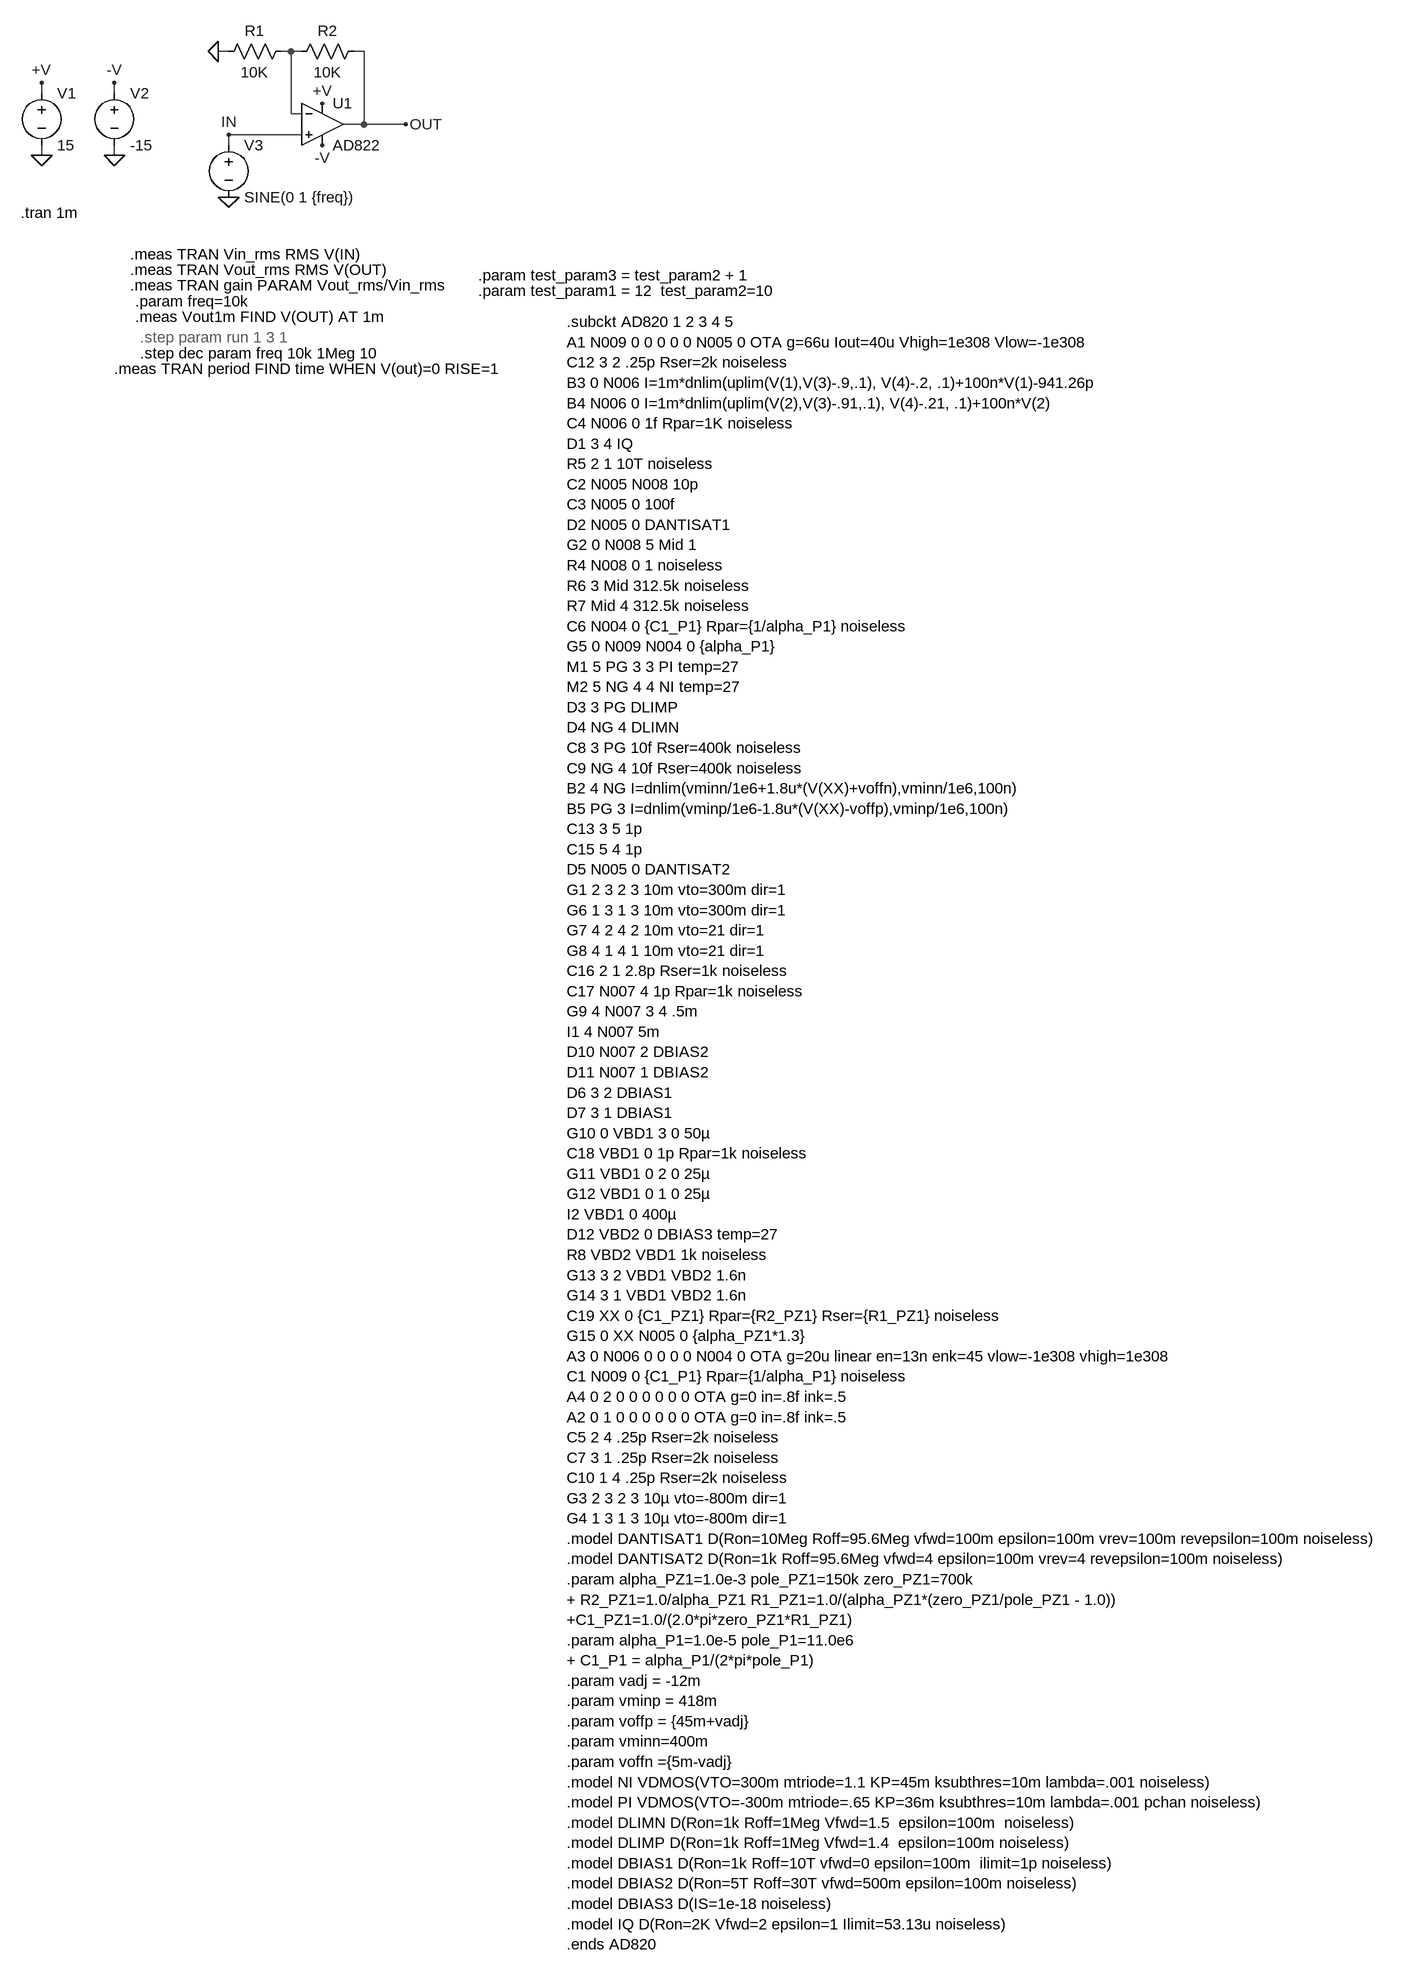
[diagram p0: schematic Batch_Test.asc]
Batch_Test.asc, the LTspice schematic file:
Version 4
SHEET 1 2320 1456
WIRE 432 -1216 416 -1216
WIRE 528 -1216 512 -1216
WIRE 544 -1216 528 -1216
WIRE 640 -1216 624 -1216
WIRE 144 -1152 144 -1168
WIRE 256 -1152 256 -1168
WIRE 528 -1120 528 -1216
WIRE 544 -1120 528 -1120
WIRE 640 -1104 640 -1216
WIRE 640 -1104 608 -1104
WIRE 704 -1104 640 -1104
WIRE 544 -1088 432 -1088
WIRE 432 -1072 432 -1088
WIRE 144 -1056 144 -1072
WIRE 256 -1056 256 -1072
FLAG 144 -1168 +V
FLAG 144 -1056 0
FLAG 704 -1104 OUT
FLAG 432 -1088 IN
FLAG 576 -1136 +V
FLAG 256 -1168 -V
FLAG 576 -1072 -V
FLAG 416 -1216 0
FLAG 256 -1056 0
FLAG 432 -992 0
SYMBOL voltage 144 -1168 R0
WINDOW 123 0 0 Left 2
WINDOW 39 0 0 Left 2
SYMATTR InstName V1
SYMATTR Value 15
SYMBOL res 528 -1232 R90
WINDOW 0 0 56 VBottom 2
WINDOW 3 32 56 VTop 2
SYMATTR InstName R1
SYMATTR Value 10K
SYMBOL res 640 -1232 R90
WINDOW 0 0 56 VBottom 2
WINDOW 3 32 56 VTop 2
SYMATTR InstName R2
SYMATTR Value 10K
SYMBOL voltage 256 -1168 R0
WINDOW 123 24 146 Left 2
WINDOW 39 24 125 Left 2
SYMATTR InstName V2
SYMATTR Value -15
SYMBOL voltage 432 -1088 R0
WINDOW 123 0 0 Left 0
WINDOW 39 0 0 Left 0
SYMATTR InstName V3
SYMATTR Value SINE(0 1 {freq})
SYMBOL Opamps\\AD822 576 -1168 R0
SYMATTR InstName U1
TEXT 112 -968 Left 2 !.tran 1m
TEXT 280 -880 Left 2 !.meas TRAN Vout_rms RMS V(OUT)
TEXT 280 -904 Left 2 !.meas TRAN Vin_rms RMS V(IN)
TEXT 280 -856 Left 2 !.meas TRAN gain PARAM Vout_rms/Vin_rms
TEXT 288 -832 Left 2 !.param freq=10k
TEXT 296 -776 Left 2 ;.step param run 1 3 1
TEXT 288 -808 Left 2 !.meas Vout1m FIND V(OUT) AT 1m
TEXT 256 -728 Left 2 !.meas TRAN period FIND time WHEN V(out)=0 RISE=1
TEXT 816 -872 Left 2 !.param test_param3 = test_param2 + 1
TEXT 816 -848 Left 2 !.param test_param1 = 12  test_param2=10
TEXT 296 -752 Left 2 !.step dec param freq 10k 1Meg 10
TEXT 952 -800 Left 2 !.subckt AD820 1 2 3 4 5\nA1 N009 0 0 0 0 0 N005 0 OTA g=66u Iout=40u Vhigh=1e308 Vlow=-1e308\nC12 3 2 .25p Rser=2k noiseless\nB3 0 N006 I=1m*dnlim(uplim(V(1),V(3)-.9,.1), V(4)-.2, .1)+100n*V(1)-941.26p\nB4 N006 0 I=1m*dnlim(uplim(V(2),V(3)-.91,.1), V(4)-.21, .1)+100n*V(2)\nC4 N006 0 1f Rpar=1K noiseless\nD1 3 4 IQ\nR5 2 1 10T noiseless\nC2 N005 N008 10p\nC3 N005 0 100f\nD2 N005 0 DANTISAT1\nG2 0 N008 5 Mid 1\nR4 N008 0 1 noiseless\nR6 3 Mid 312.5k noiseless\nR7 Mid 4 312.5k noiseless\nC6 N004 0 {C1_P1} Rpar={1/alpha_P1} noiseless\nG5 0 N009 N004 0 {alpha_P1}\nM1 5 PG 3 3 PI temp=27\nM2 5 NG 4 4 NI temp=27\nD3 3 PG DLIMP\nD4 NG 4 DLIMN\nC8 3 PG 10f Rser=400k noiseless\nC9 NG 4 10f Rser=400k noiseless\nB2 4 NG I=dnlim(vminn/1e6+1.8u*(V(XX)+voffn),vminn/1e6,100n)\nB5 PG 3 I=dnlim(vminp/1e6-1.8u*(V(XX)-voffp),vminp/1e6,100n)\nC13 3 5 1p\nC15 5 4 1p\nD5 N005 0 DANTISAT2\nG1 2 3 2 3 10m vto=300m dir=1\nG6 1 3 1 3 10m vto=300m dir=1\nG7 4 2 4 2 10m vto=21 dir=1\nG8 4 1 4 1 10m vto=21 dir=1\nC16 2 1 2.8p Rser=1k noiseless\nC17 N007 4 1p Rpar=1k noiseless\nG9 4 N007 3 4 .5m\nI1 4 N007 5m\nD10 N007 2 DBIAS2\nD11 N007 1 DBIAS2\nD6 3 2 DBIAS1\nD7 3 1 DBIAS1\nG10 0 VBD1 3 0 50µ\nC18 VBD1 0 1p Rpar=1k noiseless\nG11 VBD1 0 2 0 25µ\nG12 VBD1 0 1 0 25µ\nI2 VBD1 0 400µ\nD12 VBD2 0 DBIAS3 temp=27\nR8 VBD2 VBD1 1k noiseless\nG13 3 2 VBD1 VBD2 1.6n\nG14 3 1 VBD1 VBD2 1.6n\nC19 XX 0 {C1_PZ1} Rpar={R2_PZ1} Rser={R1_PZ1} noiseless\nG15 0 XX N005 0 {alpha_PZ1*1.3}\nA3 0 N006 0 0 0 0 N004 0 OTA g=20u linear en=13n enk=45 vlow=-1e308 vhigh=1e308\nC1 N009 0 {C1_P1} Rpar={1/alpha_P1} noiseless\nA4 0 2 0 0 0 0 0 0 OTA g=0 in=.8f ink=.5\nA2 0 1 0 0 0 0 0 0 OTA g=0 in=.8f ink=.5\nC5 2 4 .25p Rser=2k noiseless\nC7 3 1 .25p Rser=2k noiseless\nC10 1 4 .25p Rser=2k noiseless\nG3 2 3 2 3 10µ vto=-800m dir=1\nG4 1 3 1 3 10µ vto=-800m dir=1\n.model DANTISAT1 D(Ron=10Meg Roff=95.6Meg vfwd=100m epsilon=100m vrev=100m revepsilon=100m noiseless)\n.model DANTISAT2 D(Ron=1k Roff=95.6Meg vfwd=4 epsilon=100m vrev=4 revepsilon=100m noiseless)\n.param alpha_PZ1=1.0e-3 pole_PZ1=150k zero_PZ1=700k\n+ R2_PZ1=1.0/alpha_PZ1 R1_PZ1=1.0/(alpha_PZ1*(zero_PZ1/pole_PZ1 - 1.0))\n+C1_PZ1=1.0/(2.0*pi*zero_PZ1*R1_PZ1)\n.param alpha_P1=1.0e-5 pole_P1=11.0e6\n+ C1_P1 = alpha_P1/(2*pi*pole_P1)\n.param vadj = -12m\n.param vminp = 418m\n.param voffp = {45m+vadj}\n.param vminn=400m\n.param voffn ={5m-vadj}\n.model NI VDMOS(VTO=300m mtriode=1.1 KP=45m ksubthres=10m lambda=.001 noiseless)\n.model PI VDMOS(VTO=-300m mtriode=.65 KP=36m ksubthres=10m lambda=.001 pchan noiseless)\n.model DLIMN D(Ron=1k Roff=1Meg Vfwd=1.5  epsilon=100m  noiseless)\n.model DLIMP D(Ron=1k Roff=1Meg Vfwd=1.4  epsilon=100m noiseless)\n.model DBIAS1 D(Ron=1k Roff=10T vfwd=0 epsilon=100m  ilimit=1p noiseless)\n.model DBIAS2 D(Ron=5T Roff=30T vfwd=500m epsilon=100m noiseless)\n.model DBIAS3 D(IS=1e-18 noiseless)\n.model IQ D(Ron=2K Vfwd=2 epsilon=1 Ilimit=53.13u noiseless)\n.ends AD820

The netlist it stands for:
* Batch_Test.asc
V1 +V 0 15
R1 N001 0 10K
R2 OUT N001 10K
V2 -V 0 -15
V3 IN 0 SINE(0 1 {freq})
XU1 IN N001 +V -V OUT AD822  ; pins In+ In- V+ V- OUT
.tran 1m
.meas TRAN Vout_rms RMS V(OUT)
.meas TRAN Vin_rms RMS V(IN)
.meas TRAN gain PARAM Vout_rms/Vin_rms
.param freq=10k
* .step param run 1 3 1
.meas Vout1m FIND V(OUT) AT 1m
.meas TRAN period FIND time WHEN V(out)=0 RISE=1
.param test_param3 = test_param2 + 1
.param test_param1 = 12  test_param2=10
.step dec param freq 10k 1Meg 10
.subckt AD820 1 2 3 4 5
A1 N009 0 0 0 0 0 N005 0 OTA g=66u Iout=40u Vhigh=1e308 Vlow=-1e308
C12 3 2 .25p Rser=2k noiseless
B3 0 N006 I=1m*dnlim(uplim(V(1),V(3)-.9,.1), V(4)-.2, .1)+100n*V(1)-941.26p
B4 N006 0 I=1m*dnlim(uplim(V(2),V(3)-.91,.1), V(4)-.21, .1)+100n*V(2)
C4 N006 0 1f Rpar=1K noiseless
D1 3 4 IQ
R5 2 1 10T noiseless
C2 N005 N008 10p
C3 N005 0 100f
D2 N005 0 DANTISAT1
G2 0 N008 5 Mid 1
R4 N008 0 1 noiseless
R6 3 Mid 312.5k noiseless
R7 Mid 4 312.5k noiseless
C6 N004 0 {C1_P1} Rpar={1/alpha_P1} noiseless
G5 0 N009 N004 0 {alpha_P1}
M1 5 PG 3 3 PI temp=27
M2 5 NG 4 4 NI temp=27
D3 3 PG DLIMP
D4 NG 4 DLIMN
C8 3 PG 10f Rser=400k noiseless
C9 NG 4 10f Rser=400k noiseless
B2 4 NG I=dnlim(vminn/1e6+1.8u*(V(XX)+voffn),vminn/1e6,100n)
B5 PG 3 I=dnlim(vminp/1e6-1.8u*(V(XX)-voffp),vminp/1e6,100n)
C13 3 5 1p
C15 5 4 1p
D5 N005 0 DANTISAT2
G1 2 3 2 3 10m vto=300m dir=1
G6 1 3 1 3 10m vto=300m dir=1
G7 4 2 4 2 10m vto=21 dir=1
G8 4 1 4 1 10m vto=21 dir=1
C16 2 1 2.8p Rser=1k noiseless
C17 N007 4 1p Rpar=1k noiseless
G9 4 N007 3 4 .5m
I1 4 N007 5m
D10 N007 2 DBIAS2
D11 N007 1 DBIAS2
D6 3 2 DBIAS1
D7 3 1 DBIAS1
G10 0 VBD1 3 0 50µ
C18 VBD1 0 1p Rpar=1k noiseless
G11 VBD1 0 2 0 25µ
G12 VBD1 0 1 0 25µ
I2 VBD1 0 400µ
D12 VBD2 0 DBIAS3 temp=27
R8 VBD2 VBD1 1k noiseless
G13 3 2 VBD1 VBD2 1.6n
G14 3 1 VBD1 VBD2 1.6n
C19 XX 0 {C1_PZ1} Rpar={R2_PZ1} Rser={R1_PZ1} noiseless
G15 0 XX N005 0 {alpha_PZ1*1.3}
A3 0 N006 0 0 0 0 N004 0 OTA g=20u linear en=13n enk=45 vlow=-1e308 vhigh=1e308
C1 N009 0 {C1_P1} Rpar={1/alpha_P1} noiseless
A4 0 2 0 0 0 0 0 0 OTA g=0 in=.8f ink=.5
A2 0 1 0 0 0 0 0 0 OTA g=0 in=.8f ink=.5
C5 2 4 .25p Rser=2k noiseless
C7 3 1 .25p Rser=2k noiseless
C10 1 4 .25p Rser=2k noiseless
G3 2 3 2 3 10µ vto=-800m dir=1
G4 1 3 1 3 10µ vto=-800m dir=1
.model DANTISAT1 D(Ron=10Meg Roff=95.6Meg vfwd=100m epsilon=100m vrev=100m revepsilon=100m noiseless)
.model DANTISAT2 D(Ron=1k Roff=95.6Meg vfwd=4 epsilon=100m vrev=4 revepsilon=100m noiseless)
.param alpha_PZ1=1.0e-3 pole_PZ1=150k zero_PZ1=700k
+ R2_PZ1=1.0/alpha_PZ1 R1_PZ1=1.0/(alpha_PZ1*(zero_PZ1/pole_PZ1 - 1.0))
+C1_PZ1=1.0/(2.0*pi*zero_PZ1*R1_PZ1)
.param alpha_P1=1.0e-5 pole_P1=11.0e6
+ C1_P1 = alpha_P1/(2*pi*pole_P1)
.param vadj = -12m
.param vminp = 418m
.param voffp = {45m+vadj}
.param vminn=400m
.param voffn ={5m-vadj}
.model NI VDMOS(VTO=300m mtriode=1.1 KP=45m ksubthres=10m lambda=.001 noiseless)
.model PI VDMOS(VTO=-300m mtriode=.65 KP=36m ksubthres=10m lambda=.001 pchan noiseless)
.model DLIMN D(Ron=1k Roff=1Meg Vfwd=1.5  epsilon=100m  noiseless)
.model DLIMP D(Ron=1k Roff=1Meg Vfwd=1.4  epsilon=100m noiseless)
.model DBIAS1 D(Ron=1k Roff=10T vfwd=0 epsilon=100m  ilimit=1p noiseless)
.model DBIAS2 D(Ron=5T Roff=30T vfwd=500m epsilon=100m noiseless)
.model DBIAS3 D(IS=1e-18 noiseless)
.model IQ D(Ron=2K Vfwd=2 epsilon=1 Ilimit=53.13u noiseless)
.ends AD820
.backanno
.end